# Altium schematic sheet ADAPTER_WOLF.SchDoc
size A3
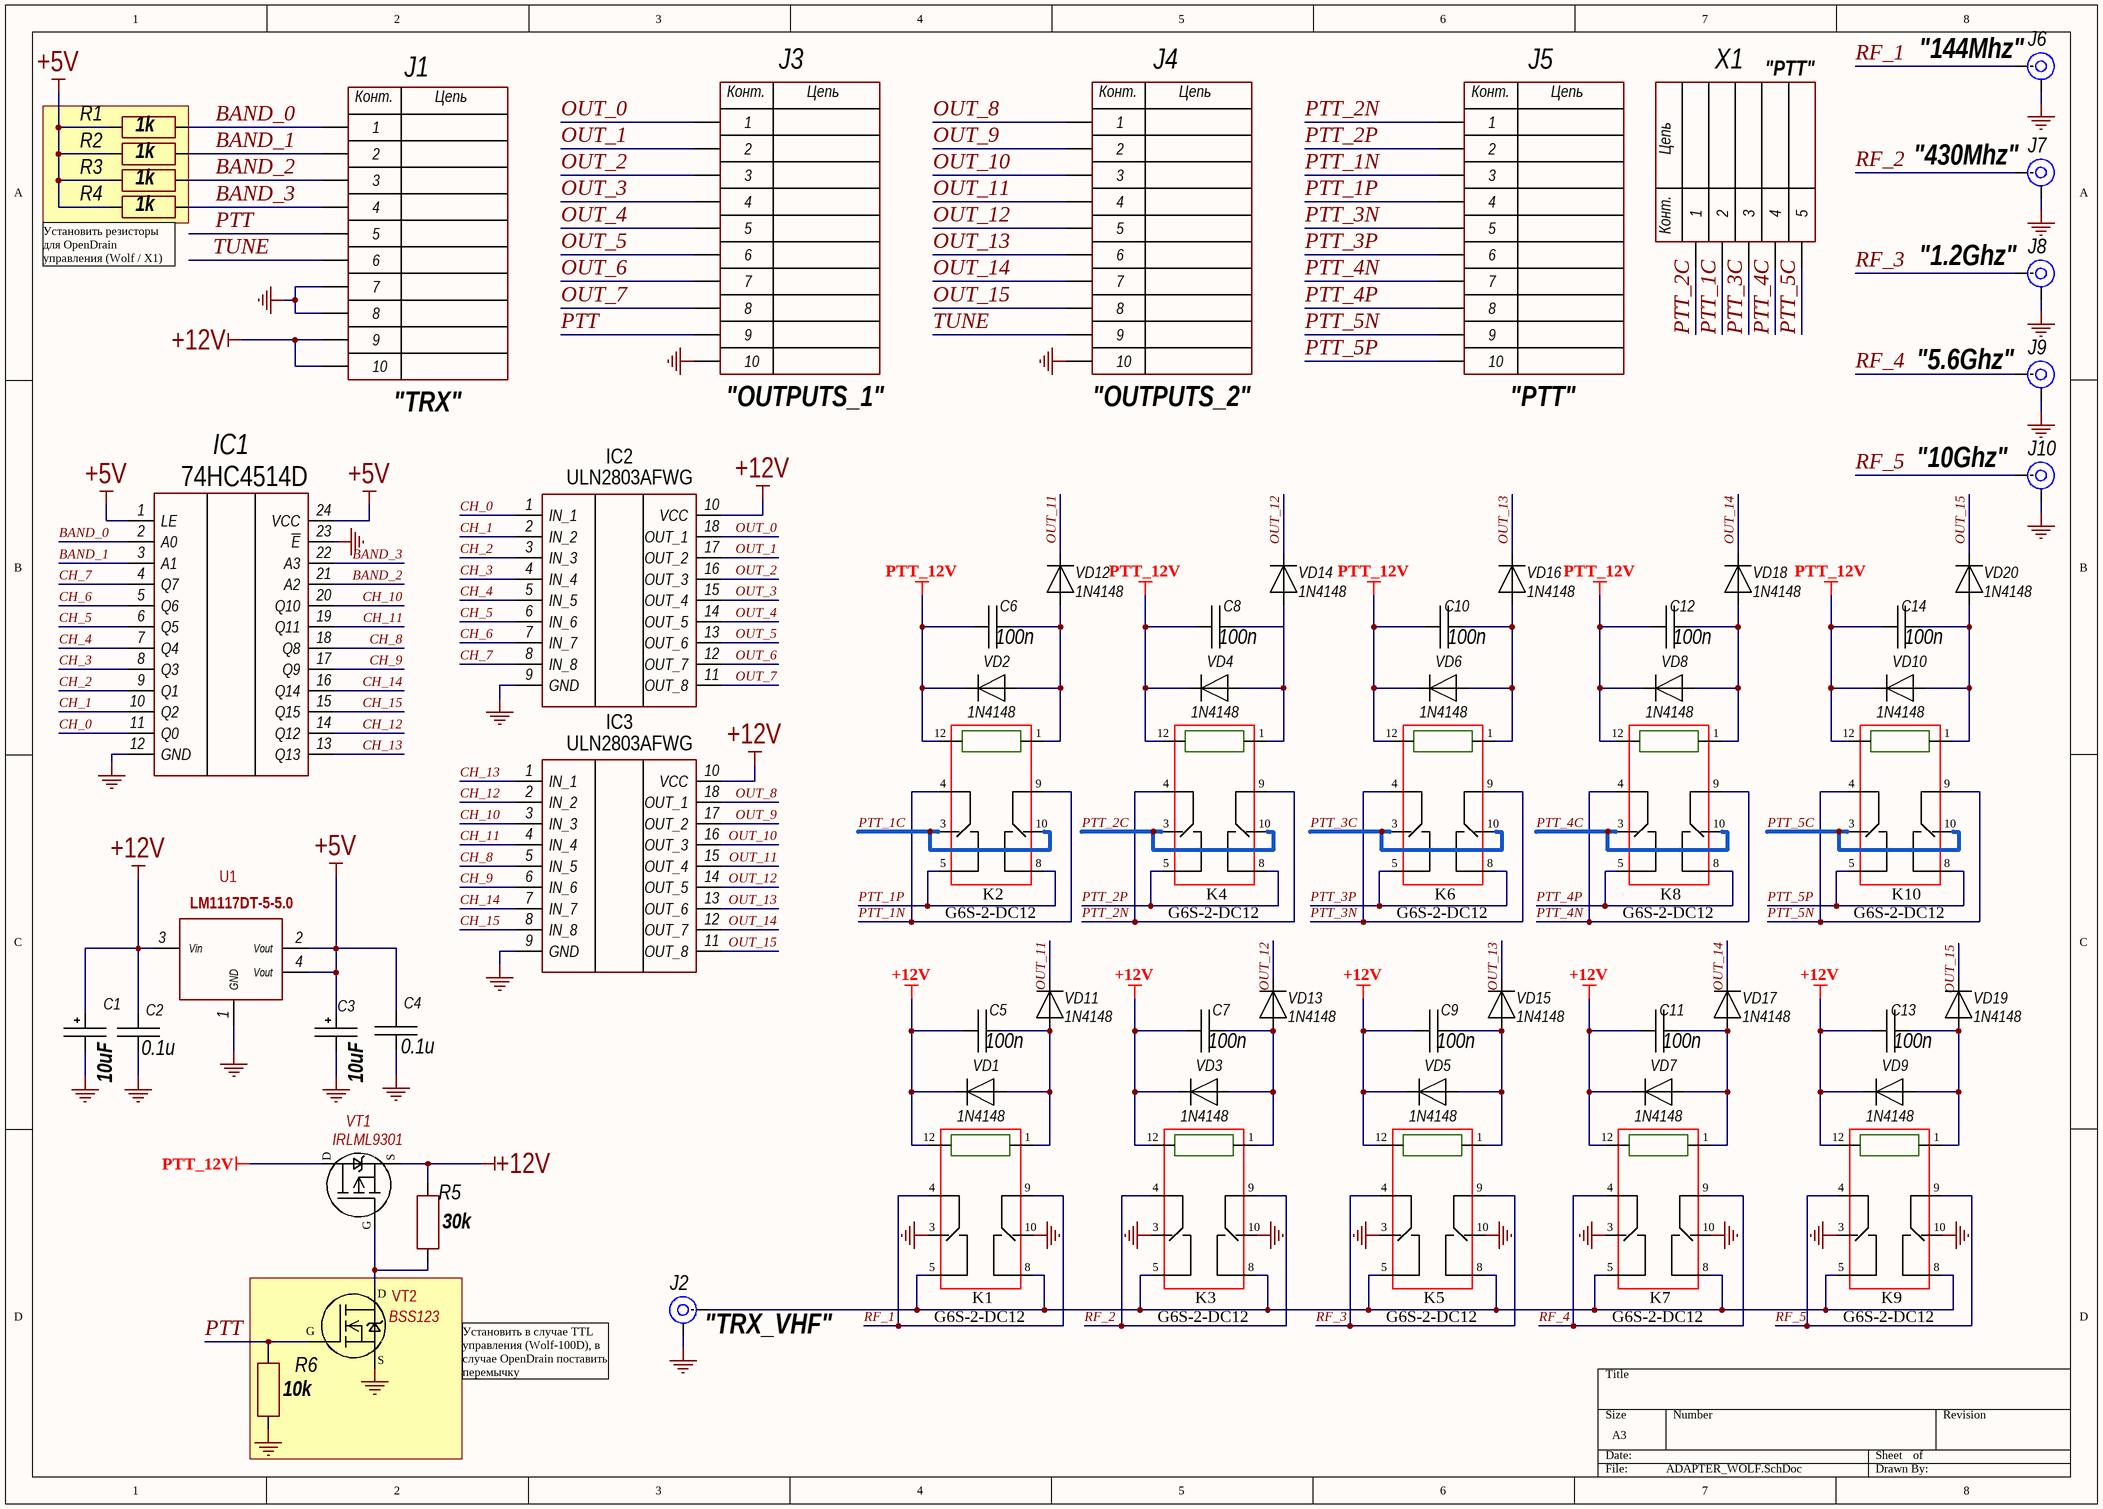
[diagram p0: ADAPTER_WOLF.SchDoc]

## Parts
C1  10uF  [TANTAL_B]
C2  0.1u  [CH0805C]
C3  10uF  [TANTAL_B]
C4  0.1u  [CH0805C]
C5  100n  [CH0805C]
C6  100n  [CH0805C]
C7  100n  [CH0805C]
C8  100n  [CH0805C]
C9  100n  [CH0805C]
C10  100n  [CH0805C]
C11  100n  [CH0805C]
C12  100n  [CH0805C]
C13  100n  [CH0805C]
C14  100n  [CH0805C]
IC1  74HC4514D  [24-SOIC (W)]
IC2  ULN2803AFWG  [18-SOIC (W)]
IC3  ULN2803AFWG  [18-SOIC (W)]
J1  "TRX"  [CON: PLD-10]
J2  "TRX_VHF"  [CON: SMA]
J3  "OUTPUTS_1"  [CON: PLD-10]
J4  "OUTPUTS_2"  [CON: PLD-10]
J5  "PTT"  [CON: PLD-10]
J6  "144Mhz"  [CON: SMA]
J7  "430Mhz"  [CON: SMA]
J8  "1.2Ghz"  [CON: SMA]
J9  "5.6Ghz"  [CON: SMA]
J10  "10Ghz"  [CON: SMA]
K1  G6S-2-DС12  [G6S-2-DC12]
K2  G6S-2-DС12  [G6S-2-DC12]
K3  G6S-2-DС12  [G6S-2-DC12]
K4  G6S-2-DС12  [G6S-2-DC12]
K5  G6S-2-DС12  [G6S-2-DC12]
K6  G6S-2-DС12  [G6S-2-DC12]
K7  G6S-2-DС12  [G6S-2-DC12]
K8  G6S-2-DС12  [G6S-2-DC12]
K9  G6S-2-DС12  [G6S-2-DC12]
K10  G6S-2-DС12  [G6S-2-DC12]
R1  1k  [CH0805R]
R2  1k  [CH0805R]
R3  1k  [CH0805R]
R4  1k  [CH0805R]
R5  30k  [CH0805R]
R6  10k  [CH0805R]
U1  LM1117DT-5-5.0  [SOT223]
VD1  1N4148  [1N4148]
VD2  1N4148  [1N4148]
VD3  1N4148  [1N4148]
VD4  1N4148  [1N4148]
VD5  1N4148  [1N4148]
VD6  1N4148  [1N4148]
VD7  1N4148  [1N4148]
VD8  1N4148  [1N4148]
VD9  1N4148  [1N4148]
VD10  1N4148  [1N4148]
VD11  1N4148  [1N4148]
VD12  1N4148  [1N4148]
VD13  1N4148  [1N4148]
VD14  1N4148  [1N4148]
VD15  1N4148  [1N4148]
VD16  1N4148  [1N4148]
VD17  1N4148  [1N4148]
VD18  1N4148  [1N4148]
VD19  1N4148  [1N4148]
VD20  1N4148  [1N4148]
VT1  IRLML9301  [SOT23_132]
VT2  BSS123  [SOT23_132]
X1  "PTT"  [CON: PLS-5]

## Nets
+5V: C3.1 C4.2 IC1.1(LE) IC1.24(VCC) R1.1 R2.1 R3.1 R4.1 U1.2(Vout) U1.4(Vout)
+12V: C1.1 C2.2 C5.1 C7.1 C9.1 C11.1 C13.1 IC2.10(VCC) IC3.10(VCC) J1.9 J1.10 K1.12 K3.12 K5.12 K7.12 K9.12 R5.2 U1.3(Vin) VD1.2 VD3.2 VD5.2 VD7.2 VD9.2 VT1.2(Исток)
GND: C1.2 C2.1 C3.2 C4.1 IC1.12(GND) IC1.23(~{E}) IC2.9(GND) IC3.9(GND) J1.7 J1.8 J2.2(IN) J3.10 J4.10 J6.2(IN) J7.2(IN) J8.2(IN) J9.2(IN) J10.2(IN) K1.3 K1.10 K3.3 K3.10 K5.3 K5.10 K7.3 K7.10 K9.3 K9.10 R6.1 U1.1(GND) VT2.2(Исток)
PTT_12V: C6.1 C8.1 C10.1 C12.1 C14.1 K2.12 K4.12 K6.12 K8.12 K10.12 VD2.2 VD4.2 VD6.2 VD8.2 VD10.2 VT1.3(Сток)
BAND_0: IC1.2(A0) J1.1 R1.2
BAND_1: IC1.3(A1) J1.2 R2.2
BAND_2: IC1.21(A2) J1.3 R3.2
BAND_3: IC1.22(A3) J1.4 R4.2
CH_0: IC1.11(Q0) IC2.1(IN_1)
CH_1: IC1.10(Q2) IC2.2(IN_2)
CH_2: IC1.9(Q1) IC2.3(IN_3)
CH_3: IC1.8(Q3) IC2.4(IN_4)
CH_4: IC1.7(Q4) IC2.5(IN_5)
CH_5: IC1.6(Q5) IC2.6(IN_6)
CH_6: IC1.5(Q6) IC2.7(IN_7)
CH_7: IC1.4(Q7) IC2.8(IN_8)
CH_8: IC1.18(Q8) IC3.5(IN_5)
CH_9: IC1.17(Q9) IC3.6(IN_6)
CH_10: IC1.20(Q10) IC3.3(IN_3)
CH_11: IC1.19(Q11) IC3.4(IN_4)
CH_12: IC1.14(Q12) IC3.2(IN_2)
CH_13: IC1.13(Q13) IC3.1(IN_1)
CH_14: IC1.16(Q14) IC3.7(IN_7)
CH_15: IC1.15(Q15) IC3.8(IN_8)
OUT_0: IC2.18(OUT_1) J3.1
OUT_1: IC2.17(OUT_2) J3.2
OUT_2: IC2.16(OUT_3) J3.3
OUT_3: IC2.15(OUT_4) J3.4
OUT_4: IC2.14(OUT_5) J3.5
OUT_5: IC2.13(OUT_6) J3.6
OUT_6: IC2.12(OUT_7) J3.7
OUT_7: IC2.11(OUT_8) J3.8
OUT_8: IC3.18(OUT_1) J4.1
OUT_9: IC3.17(OUT_2) J4.2
OUT_10: IC3.16(OUT_3) J4.3
OUT_11: IC3.15(OUT_4) J4.4 VD11.2 VD12.2
OUT_12: IC3.14(OUT_5) J4.5 VD13.2 VD14.2
OUT_13: IC3.13(OUT_6) J4.6 VD15.2 VD16.2
OUT_14: IC3.12(OUT_7) J4.7 VD17.2 VD18.2
OUT_15: IC3.11(OUT_8) J4.8 VD19.2 VD20.2
PTT: J1.5 J3.9 R6.2 VT2.1(Затвор)
PTT_1N: J5.3 K2.4 K2.9
PTT_1P: J5.4 K2.5 K2.8
PTT_1С: K2.3 K2.10 X1.2
PTT_2N: J5.1 K4.4 K4.9
PTT_2P: J5.2 K4.5 K4.8
PTT_2С: K4.3 K4.10 X1.1
PTT_3N: J5.5 K6.4 K6.9
PTT_3P: J5.6 K6.5 K6.8
PTT_3С: K6.3 K6.10 X1.3
PTT_4N: J5.7 K8.4 K8.9
PTT_4P: J5.8 K8.5 K8.8
PTT_4С: K8.3 K8.10 X1.4
PTT_5N: J5.9 K10.4 K10.9
PTT_5P: J5.10 K10.5 K10.8
PTT_5С: K10.3 K10.10 X1.5
RF_1: J6.1(IN) K1.4 K1.9
RF_2: J7.1(IN) K3.4 K3.9
RF_3: J8.1(IN) K5.4 K5.9
RF_4: J9.1(IN) K7.4 K7.9
RF_5: J10.1(IN) K9.4 K9.9
TUNE: J1.6 J4.9
NetC5_2: C5.2 K1.1 VD1.1 VD11.1
NetC6_2: C6.2 K2.1 VD2.1 VD12.1
NetC7_2: C7.2 K3.1 VD3.1 VD13.1
NetC8_2: C8.2 K4.1 VD4.1 VD14.1
NetC9_2: C9.2 K5.1 VD5.1 VD15.1
NetC10_2: C10.2 K6.1 VD6.1 VD16.1
NetC11_2: C11.2 K7.1 VD7.1 VD17.1
NetC12_2: C12.2 K8.1 VD8.1 VD18.1
NetC13_2: C13.2 K9.1 VD9.1 VD19.1
NetC14_2: C14.2 K10.1 VD10.1 VD20.1
NetJ2_1: J2.1(IN) K1.5 K1.8 K3.5 K3.8 K5.5 K5.8 K7.5 K7.8 K9.5 K9.8
NetR5_1: R5.1 VT1.1(Затвор(Gate)) VT2.3(Сток)

## Notes on the sheet
- (near R4) Установить резисторы для OpenDrain управления (Wolf / X1)
- Установить в случае TTL управления (Wolf-100D), в случае OpenDrain поставить перемычку
- (in symbol 5-Connector) Цепь; Конт.
- (in symbol 10-Connector) Конт.; Цепь
- (in symbol N-KANAL) D; G; S
- (in symbol P-KANAL) D; S; G

## Library data of the parts
C1 C3 = TantalCap: Manufacturer: *; Model: *; HelpURL: *; ComponentKind: *; Value: *
C2 C4-C14 = Capacitor: Manufacturer: *; Model: *; HelpURL: *; ComponentKind: *; Value: *
J1 J3-J5 = 10-Connector: Model: *; Manufacturer: *; HelpURL: *; ComponentKind: *
J2 J6-J10 = SMA: RF; Model: *; Manufacturer: *; HelpURL: *; ComponentKind: *
K1-K10 = G6S-2_TRS
R1-R6 = Resistor: Manufacturer: *; Model: *; HelpURL: *; ComponentKind: *; Value: *
U1 = AMS117
VD1-VD20 = Diod: ComponentKind: *; Manufacturer: *; Model: *; HelpURL: *
VT1 = P-KANAL
VT2 = N-KANAL
X1 = 5-Connector: Model: *; Manufacturer: *; HelpURL: *; ComponentKind: *